# Altium project ADCSBoard.PrjPCB
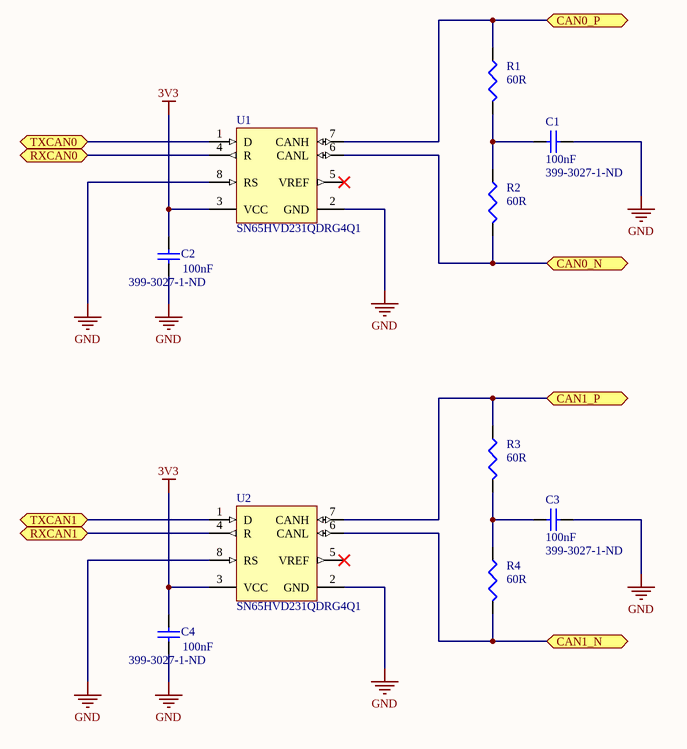
[diagram p0: CAN.SchDoc]
5 sheets, 69 parts. Net scope: flat (ports and power ports of the same name join across sheets).
Board file: SubSystems Development Board.PcbDoc
Sheets:
  CAN.SchDoc
  MCU Support.SchDoc
  MCU.SchDoc
  PERIPHERALS.SchDoc
  PINS.SchDoc

## Sheet CAN.SchDoc
size A4

### Parts
C1  value 100nF  Supplier Part Number 1: 399-3027-1-ND  [0402C-TBD]  (hidden comment: Cap Semi)
C2  value 100nF  Supplier Part Number 1: 399-3027-1-ND  [0402C-TBD]  (hidden comment: Cap Semi)
C3  value 100nF  Supplier Part Number 1: 399-3027-1-ND  [0402C-TBD]  (hidden comment: Cap Semi)
C4  value 100nF  Supplier Part Number 1: 399-3027-1-ND  [0402C-TBD]  (hidden comment: Cap Semi)
R1  value 60R  [0402R-TBD]  (hidden comment: Res3)
R2  value 60R  [0402R-TBD]  (hidden comment: Res3)
R3  value 60R  [0402R-TBD]  (hidden comment: Res3)
R4  value 60R  [0402R-TBD]  (hidden comment: Res3)
U1  SN65HVD231QDRG4Q1  [D8_M]
U2  SN65HVD231QDRG4Q1  [D8_M]

### Ports
CAN0_N (bidir), CAN0_P (bidir), CAN1_N (bidir), CAN1_P (bidir), RXCAN0 (bidir), RXCAN1 (bidir), TXCAN0 (bidir), TXCAN1 (bidir)

### Nets
3V3: C2.1 C4.1 U1.3(VCC) U2.3(VCC)
GND: C1.2 C2.2 C3.2 C4.2 U1.2(GND) U1.8(RS) U2.2(GND) U2.8(RS)
RXCAN0: U1.4(R) ; port RXCAN0
RXCAN1: U2.4(R) ; port RXCAN1
TXCAN0: U1.1(D) ; port TXCAN0
TXCAN1: U2.1(D) ; port TXCAN1
NetC1_1: C1.1 R1.2 R2.1
NetC3_1: C3.1 R3.2 R4.1
NetCAN1_1: R1.1 U1.7(CANH) ; port CAN0_P
NetCAN1_2: R3.1 U2.7(CANH) ; port CAN1_P
NetCAN1_3: R2.2 U1.6(CANL) ; port CAN0_N
NetCAN1_4: R4.2 U2.6(CANL) ; port CAN1_N

Not connected (* = marked no-connect by the designer): U1 5(VREF)*; U2 5(VREF)*

### Library data of the parts
C1-C4 = Cap Semi: Capacitor (Semiconductor SIM Model); Manufacturer: Kemet; Manufacturer Part Number: C0402C104K8PACTU; Capacitance: 0.1µF; Tolerance: ±10%; Voltage - Rated: 10V; Temperature Coefficient: X5R; Published: 8-Jun-2000; LatestRevisionDate: 29-May-2009; LatestRevisionNote: IPC-7351 Footprint Added.; PackageReference: C1206; Publisher: Altium Limited; PackageDescription: Chip Capacitor; Supplier 1: Digi-Key; RoHS: RoHS Compliant; Category: Capacitors; Stock 1: 806297; Pricing 1: 1=0.12, 10=0.031, 50=0.0174, 100=0.0147, 250=0.012, 500=0.01028, 1000=0.00799, 2500=0.0072, 5000=0.00666 (CAD); Packaging: Cut Tape (CT); Mounting Type: Surface Mount, MLCC; Operating Temperature: -55°C ~ 85°C; Applications: General Purpose; Ratings: -; Package / Case: 0402 (1005 Metric); Size / Dimension: 0.039" L x 0.020" W (1.00mm x 0.50mm); Height - Seated (Max): -; Thickness (Max): 0.022" (0.55mm); Lead Spacing: -; Features: -; Lead Style: -; ComponentLink1URL: http://www.kemet.com/docfinder?Partnumber=C0402C104K8PACTU; ComponentLink1Description: http://www.kemet.com/docfinder?Partnumber=C0402C104K8PACTU; Digi-Key Part Number: 399-3027-1-ND
R1-R4 = Res3: Resistor; Published: 8-Jun-2000; LatestRevisionDate: 29-May-2009; LatestRevisionNote: IPC-7351 Footprint Added.; PackageReference: J1-0603; Publisher: Altium Limited; PackageDescription: Chip Resistor; Digi-Key Part Number: 541-120GCT-ND
U1 U2 = CMP-0315-00034-1: Automotive Catalog CAN Transceiver, 17 mA, 3.3 V, -40 to 125 degC, 8-pin SOIC (D), Green (RoHS & no Sb/Br); Manufacturer: Texas Instruments; ICC(Max)(mA): 17; Supply Voltage(s)(V): 3.3; Receivers Per Package: 1; Transient Pulse Protection(V): -25 to 25; Mounting Technology: Surface Mount; DatasheetVersion: SGLS398A; Eco-Plan: Green (RoHS & no Sb/Br); PackageDescription: 8-Pin Plastic Small Outline Integrated Circuit, 4.9 x 3.9 mm, Pitch 1.27 mm Pitch; ComponentLink1URL: http://www.ti.com/general/docs/lit/getliterature.tsp?genericPartNumber=SN65HVD231Q-Q1&fileType=pdf; Isolated: No; SubFamily: CAN; Rating: Automotive; ComponentLink1Description: Datasheet; PackageVersion: revM, Jun-2011; Code_JEDEC: MS-012AA; Footprint: PCA82C250; PartNumber: SN65HVD231QDRG4Q1; PackageReference: D8; Drivers Per Package: 1

## Sheet MCU Support.SchDoc
size A4
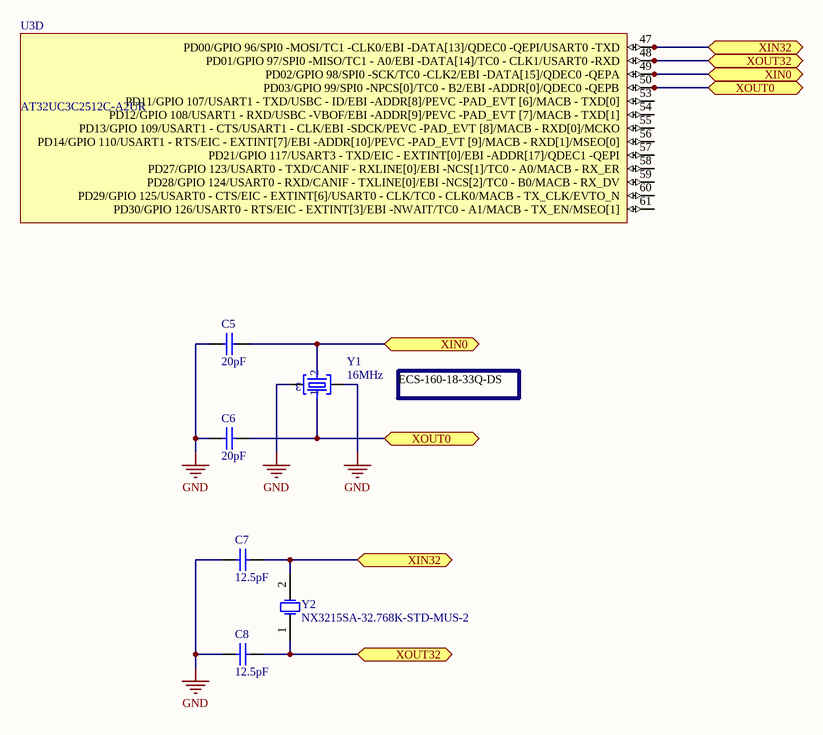
[diagram p1: MCU Support.SchDoc]

### Parts
(Parts that share a designator on the sheet are numbered #1, #2 ... from top to bottom, then left to right.)
C5  value 20pF  [0402C-TBD]  (hidden comment: Cap Semi)
C6  value 20pF  [0402C-TBD]  (hidden comment: Cap Semi)
C7  value 12.5pF  [0402C-TBD]  (hidden comment: Cap Semi)
C8  value 12.5pF  [0402C-TBD]  (hidden comment: Cap Semi)
U3#1  AT32UC3C2512C-A2UR  [TQFP64_N]  (part D of 6)
Y1  16MHz  [CRYSTAL-3.2-2.5]
Y2  NX3215SA-32.768K-STD-MUS-2  [ABRA-ABS07-2_V]

### Ports
XIN0 (bidir), XIN32 (bidir), XOUT0 (bidir), XOUT32 (bidir)

### Nets
GND: C5.2 C6.2 C7.2 C8.2 Y1.2(GND@1) Y1.4(GND@2)
NetC5_1: C5.1 U3#1.49(PD02/GPIO_98/SPI0_-SCK/TC0_-CLK2/EBI_-DATA[15]/QDEC0_-QEPA) Y1.3(C2) ; port XIN0
NetC6_1: C6.1 U3#1.50(PD03/GPIO_99/SPI0_-NPCS[0]/TC0_-_B2/EBI_-ADDR[0]/QDEC0_-QEPB) Y1.1(C1) ; port XOUT0
NetC7_1: C7.1 U3#1.47(PD00/GPIO_96/SPI0_-MOSI/TC1_-CLK0/EBI_-DATA[13]/QDEC0_-QEPI/USART0_-TXD) Y2.2(X2) ; port XIN32
NetC8_1: C8.1 U3#1.48(PD01/GPIO_97/SPI0_-MISO/TC1_-_A0/EBI_-DATA[14]/TC0_-_CLK1/USART0_-RXD) Y2.1(X1) ; port XOUT32

Not connected (* = marked no-connect by the designer): U3#1 53(PD11/GPIO_107/USART1_-_TXD/USBC_-_ID/EBI_-ADDR[8]/PEVC_-PAD_EVT_[6]/MACB_-_TXD[0]) 54(PD12/GPIO_108/USART1_-_RXD/USBC_-VBOF/EBI_-ADDR[9]/PEVC_-PAD_EVT_[7]/MACB_-_TXD[1]) 55(PD13/GPIO_109/USART1_-_CTS/USART1_-_CLK/EBI_-SDCK/PEVC_-PAD_EVT_[8]/MACB_-_RXD[0]/MCKO) 56(PD14/GPIO_110/USART1_-_RTS/EIC_-_EXTINT[7]/EBI_-ADDR[10]/PEVC_-PAD_EVT_[9]/MACB_-_RXD[1]/MSEO[0]) 57(PD21/GPIO_117/USART3_-_TXD/EIC_-_EXTINT[0]/EBI_-ADDR[17]/QDEC1_-QEPI) 58(PD27/GPIO_123/USART0_-_TXD/CANIF_-_RXLINE[0]/EBI_-NCS[1]/TC0_-_A0/MACB_-_RX_ER) 59(PD28/GPIO_124/USART0_-_RXD/CANIF_-_TXLINE[0]/EBI_-NCS[2]/TC0_-_B0/MACB_-_RX_DV) 60(PD29/GPIO_125/USART0_-_CTS/EIC_-_EXTINT[6]/USART0_-_CLK/TC0_-_CLK0/MACB_-_TX_CLK/EVTO_N) 61(PD30/GPIO_126/USART0_-_RTS/EIC_-_EXTINT[3]/EBI_-NWAIT/TC0_-_A1/MACB_-_TX_EN/MSEO[1])

### Notes on the sheet
- ECS-160-18-33Q-DS

### Library data of the parts
C5-C8 = Cap Semi: Capacitor (Semiconductor SIM Model); Published: 8-Jun-2000; LatestRevisionDate: 29-May-2009; LatestRevisionNote: IPC-7351 Footprint Added.; PackageReference: C1206; Publisher: Altium Limited; PackageDescription: Chip Capacitor
U3#1 = CMP-0092-00216-1: 32-bit AVR UC3 C Series Microcontroller, 512KB Flash, 68KB SRAM, 45 GPIO pins, Industrial Grade, 64- Pin TQFP, Reel; ComponentLink3URL: http://www.atmel.com/dyn/resources/prod_documents/32117s.pdf; PackageReference: TQFP64; ComponentLink3Description: AT32UC3C Summary; PackageVersion: 2011; DatasheetVersion: revC, Aug-2011; ComponentLink1Description: Manufacturer URL; ComponentLink2URL: http://www.atmel.com/dyn/resources/prod_documents/doc32117.pdf; ComponentLink2Description: AT32UC3C Datasheet; Code_JEDEC: MS-026; PackageDescription: 64-Pin Thin Quad Flat Pack, 10 x 10 x 1.0 mm Body, 0.5 mm Pitch; ComponentLink1URL: http://www.atmel.com/; PartId: 1
Y1 = CRYSTAL-3.2-2.5: Mouser Part Number: 581-CX3225GB22579PHP
Y2 = CMP-0447-00001-2: Crystal, 32.768 kHz, 12.5 pF, -40 to 85 degC, SMD Low Profile 3.2 x 1.5 x 0.9 mm, Tape and Reel; Manufacturer: Abracon; PartNumber: ABS07-32.768KHz-T; Q Value (Type): 30000; Operation Mode: Flexural Mode (Tuning Fork); Shunt Capacitance (C0): 0.9 to 1.2 pF; Load Capacitance (CL): 12.5 pF; Frequency Tolerance @+25degC: +/- 20 ppm; Drive Level (Type): 0.1 uW; Equivalent Series Resistance (R1): 70 Kohm; Insulation Resistance (Min): 500 Mohm; ComponentLink3URL: http://www.abracon.com/Resonators/ABS07.pdf; PackageDescription: 2-Pin Hand Drawn, Body 3.2x1.5mm, Pitch 2.5mm; Operating Temperature: -40 to 85 degC; ComponentLink2URL: http://www.abracon.com/Resonators/ABS07.pdf; PackageReference: ABS07-2; ComponentLink3Description: Package Specification; ComponentLink1Description: Manufacturer URL; DatasheetVersion: 04.03.13; Mounting Technology: Surface Mount; ComponentLink2Description: Datasheet; ComponentLink1URL: http://www.abracon.com/; Packing: Tape and Reel; Frequency: 32.768 kHz; Digi-Key Part Number: 535-9542-6-ND

## Sheet MCU.SchDoc
size A4
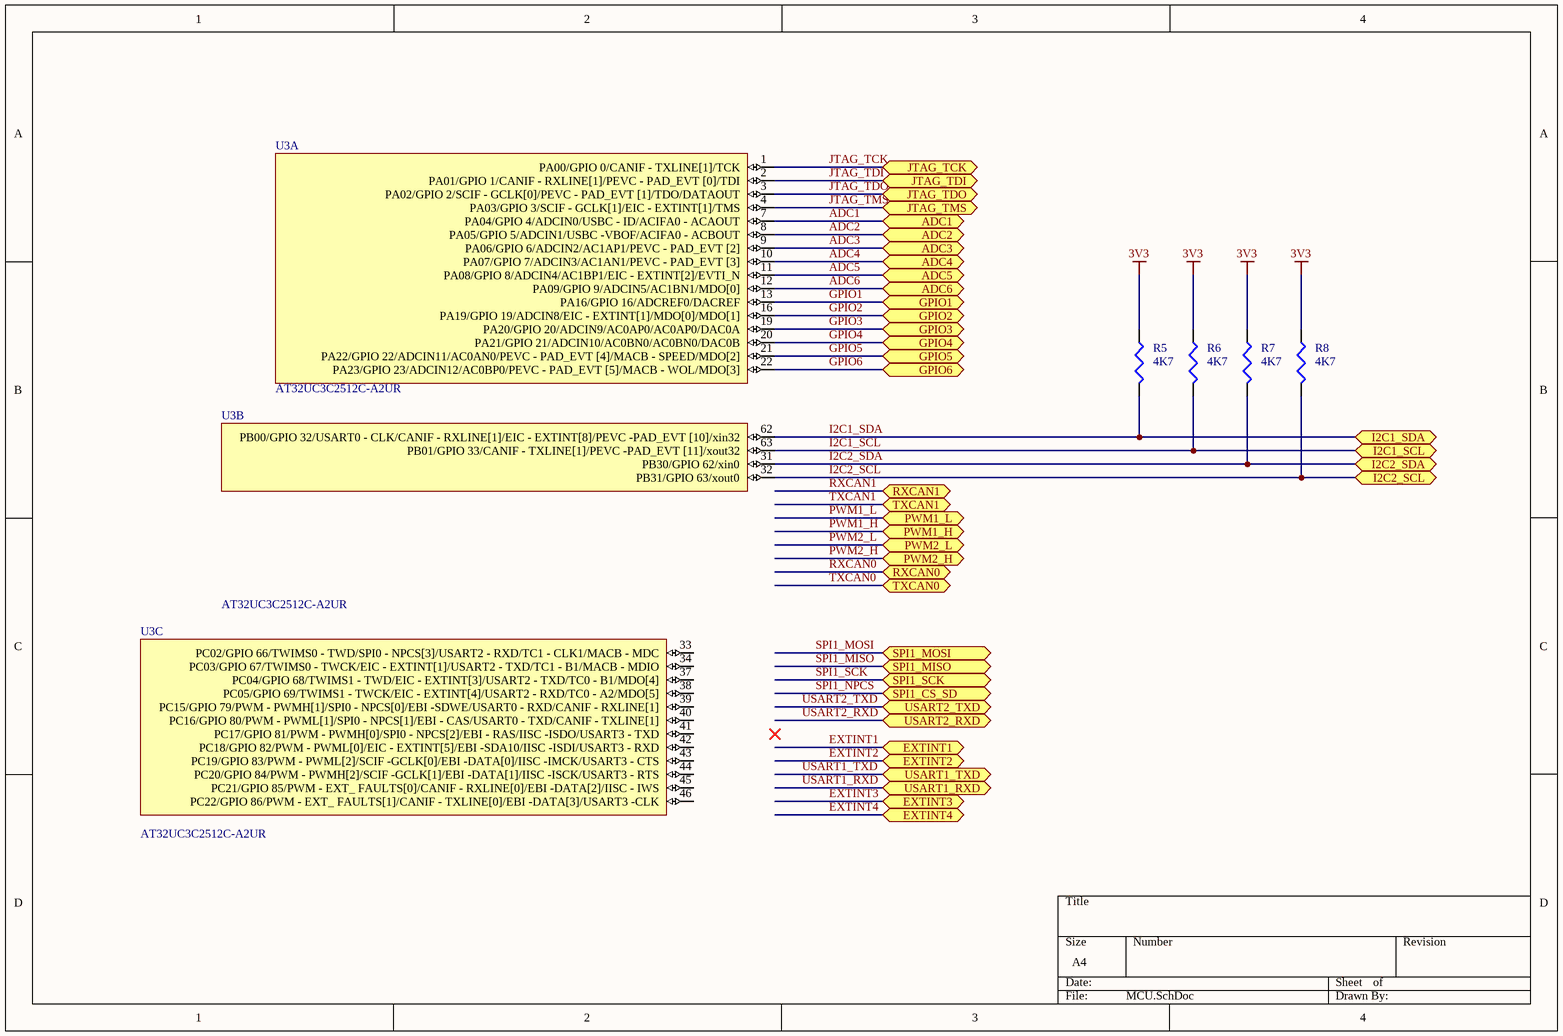
[diagram p2: MCU.SchDoc]

### Parts
(Parts that share a designator on the sheet are numbered #1, #2 ... from top to bottom, then left to right.)
R5  value 4K7  [0402R-TBD]  (hidden comment: Res3)
R6  value 4K7  [0402R-TBD]  (hidden comment: Res3)
R7  value 4K7  [0402R-TBD]  (hidden comment: Res3)
R8  value 4K7  [0402R-TBD]  (hidden comment: Res3)
U3#1  AT32UC3C2512C-A2UR  [TQFP64_N]  (parts B,C of 6)
U3#2  AT32UC3C2512C-A2UR  [TQFP64_N]  (part A of 6)

### Ports
ADC1 (bidir), ADC2 (bidir), ADC3 (bidir), ADC4 (bidir), ADC5 (bidir), ADC6 (bidir), EXTINT1 (bidir), EXTINT2 (bidir), EXTINT3 (bidir), EXTINT4 (bidir), GPIO1 (bidir), GPIO2 (bidir), GPIO3 (bidir), GPIO4 (bidir), GPIO5 (bidir), GPIO6 (bidir), I2C1_SCL (bidir), I2C1_SDA (bidir), I2C2_SCL (bidir), I2C2_SDA (bidir), JTAG_TCK (bidir), JTAG_TDI (bidir), JTAG_TDO (bidir), JTAG_TMS (bidir), PWM1_H (bidir), PWM1_L (bidir), PWM2_H (bidir), PWM2_L (bidir), RXCAN0 (bidir), RXCAN1 (bidir), SPI1_CS_SD (bidir), SPI1_MISO (bidir), SPI1_MOSI (bidir), SPI1_SCK (bidir), TXCAN0 (bidir), TXCAN1 (bidir), USART1_RXD (bidir), USART1_TXD (bidir), USART2_RXD (bidir), USART2_TXD (bidir)

### Nets
3V3: R5.1 R6.1 R7.1 R8.1
ADC1: U3#2.7(PA04/GPIO_4/ADCIN0/USBC_-_ID/ACIFA0_-_ACAOUT) ; port ADC1
ADC2: U3#2.8(PA05/GPIO_5/ADCIN1/USBC_-VBOF/ACIFA0_-_ACBOUT) ; port ADC2
ADC3: U3#2.9(PA06/GPIO_6/ADCIN2/AC1AP1/PEVC_-_PAD_EVT_[2]) ; port ADC3
ADC4: U3#2.10(PA07/GPIO_7/ADCIN3/AC1AN1/PEVC_-_PAD_EVT_[3]) ; port ADC4
ADC5: U3#2.11(PA08/GPIO_8/ADCIN4/AC1BP1/EIC_-_EXTINT[2]/EVTI_N) ; port ADC5
ADC6: U3#2.12(PA09/GPIO_9/ADCIN5/AC1BN1/MDO[0]) ; port ADC6
GPIO1: U3#2.13(PA16/GPIO_16/ADCREF0/DACREF) ; port GPIO1
GPIO2: U3#2.16(PA19/GPIO_19/ADCIN8/EIC_-_EXTINT[1]/MDO[0]/MDO[1]) ; port GPIO2
GPIO3: U3#2.19(PA20/GPIO_20/ADCIN9/AC0AP0/AC0AP0/DAC0A) ; port GPIO3
GPIO4: U3#2.20(PA21/GPIO_21/ADCIN10/AC0BN0/AC0BN0/DAC0B) ; port GPIO4
GPIO5: U3#2.21(PA22/GPIO_22/ADCIN11/AC0AN0/PEVC_-_PAD_EVT_[4]/MACB_-_SPEED/MDO[2]) ; port GPIO5
GPIO6: U3#2.22(PA23/GPIO_23/ADCIN12/AC0BP0/PEVC_-_PAD_EVT_[5]/MACB_-_WOL/MDO[3]) ; port GPIO6
I2C1_SCL: R6.2 U3#1.63(PB01/GPIO_33/CANIF_-_TXLINE[1]/PEVC_-PAD_EVT_[11]/xout32) ; port I2C1_SCL
I2C1_SDA: R5.2 U3#1.62(PB00/GPIO_32/USART0_-_CLK/CANIF_-_RXLINE[1]/EIC_-_EXTINT[8]/PEVC_-PAD_EVT_[10]/xin32) ; port I2C1_SDA
I2C2_SCL: R8.2 U3#1.32(PB31/GPIO_63/xout0) ; port I2C2_SCL
I2C2_SDA: R7.2 U3#1.31(PB30/GPIO_62/xin0) ; port I2C2_SDA
JTAG_TCK: U3#2.1(PA00/GPIO_0/CANIF_-_TXLINE[1]/TCK) ; port JTAG_TCK
JTAG_TDI: U3#2.2(PA01/GPIO_1/CANIF_-_RXLINE[1]/PEVC_-_PAD_EVT_[0]/TDI) ; port JTAG_TDI
JTAG_TDO: U3#2.3(PA02/GPIO_2/SCIF_-_GCLK[0]/PEVC_-_PAD_EVT_[1]/TDO/DATAOUT) ; port JTAG_TDO
JTAG_TMS: U3#2.4(PA03/GPIO_3/SCIF_-_GCLK[1]/EIC_-_EXTINT[1]/TMS) ; port JTAG_TMS
PWM1_H: port PWM1_H
PWM1_L: port PWM1_L
PWM2_H: port PWM2_H
PWM2_L: port PWM2_L

Not connected (* = marked no-connect by the designer): U3#1 33(PC02/GPIO_66/TWIMS0_-_TWD/SPI0_-_NPCS[3]/USART2_-_RXD/TC1_-_CLK1/MACB_-_MDC) 34(PC03/GPIO_67/TWIMS0_-_TWCK/EIC_-_EXTINT[1]/USART2_-_TXD/TC1_-_B1/MACB_-_MDIO) 37(PC04/GPIO_68/TWIMS1_-_TWD/EIC_-_EXTINT[3]/USART2_-_TXD/TC0_-_B1/MDO[4]) 38(PC05/GPIO_69/TWIMS1_-_TWCK/EIC_-_EXTINT[4]/USART2_-_RXD/TC0_-_A2/MDO[5]) 39(PC15/GPIO_79/PWM_-_PWMH[1]/SPI0_-_NPCS[0]/EBI_-SDWE/USART0_-_RXD/CANIF_-_RXLINE[1]) 40(PC16/GPIO_80/PWM_-_PWML[1]/SPI0_-_NPCS[1]/EBI_-_CAS/USART0_-_TXD/CANIF_-_TXLINE[1]) 41(PC17/GPIO_81/PWM_-_PWMH[0]/SPI0_-_NPCS[2]/EBI_-_RAS/IISC_-ISDO/USART3_-_TXD) 42(PC18/GPIO_82/PWM_-_PWML[0]/EIC_-_EXTINT[5]/EBI_-SDA10/IISC_-ISDI/USART3_-_RXD) 43(PC19/GPIO_83/PWM_-_PWML[2]/SCIF_-GCLK[0]/EBI_-DATA[0]/IISC_-IMCK/USART3_-_CTS) 44(PC20/GPIO_84/PWM_-_PWMH[2]/SCIF_-GCLK[1]/EBI_-DATA[1]/IISC_-ISCK/USART3_-_RTS) 45(PC21/GPIO_85/PWM_-_EXT__FAULTS[0]/CANIF_-_RXLINE[0]/EBI_-DATA[2]/IISC_-_IWS) 46(PC22/GPIO_86/PWM_-_EXT__FAULTS[1]/CANIF_-_TXLINE[0]/EBI_-DATA[3]/USART3_-CLK)

### Library data of the parts
R5-R8 = Res3: Resistor; Published: 8-Jun-2000; LatestRevisionDate: 29-May-2009; LatestRevisionNote: IPC-7351 Footprint Added.; PackageReference: J1-0603; Publisher: Altium Limited; PackageDescription: Chip Resistor; Digi-Key Part Number: 541-120GCT-ND
U3#1 U3#2 = CMP-0092-00216-1: as U3#1 on sheet MCU Support; ComponentLink3URL: http://www.atmel.com/dyn/resources/prod_documents/32117s.pdf; PackageReference: TQFP64; ComponentLink3Description: AT32UC3C Summary; PackageVersion: 2011; DatasheetVersion: revC, Aug-2011; ComponentLink1Description: Manufacturer URL; ComponentLink2URL: http://www.atmel.com/dyn/resources/prod_documents/doc32117.pdf; ComponentLink2Description: AT32UC3C Datasheet; Code_JEDEC: MS-026; PackageDescription: 64-Pin Thin Quad Flat Pack, 10 x 10 x 1.0 mm Body, 0.5 mm Pitch; ComponentLink1URL: http://www.atmel.com/; PartId: 1

## Sheet PERIPHERALS.SchDoc
size A4
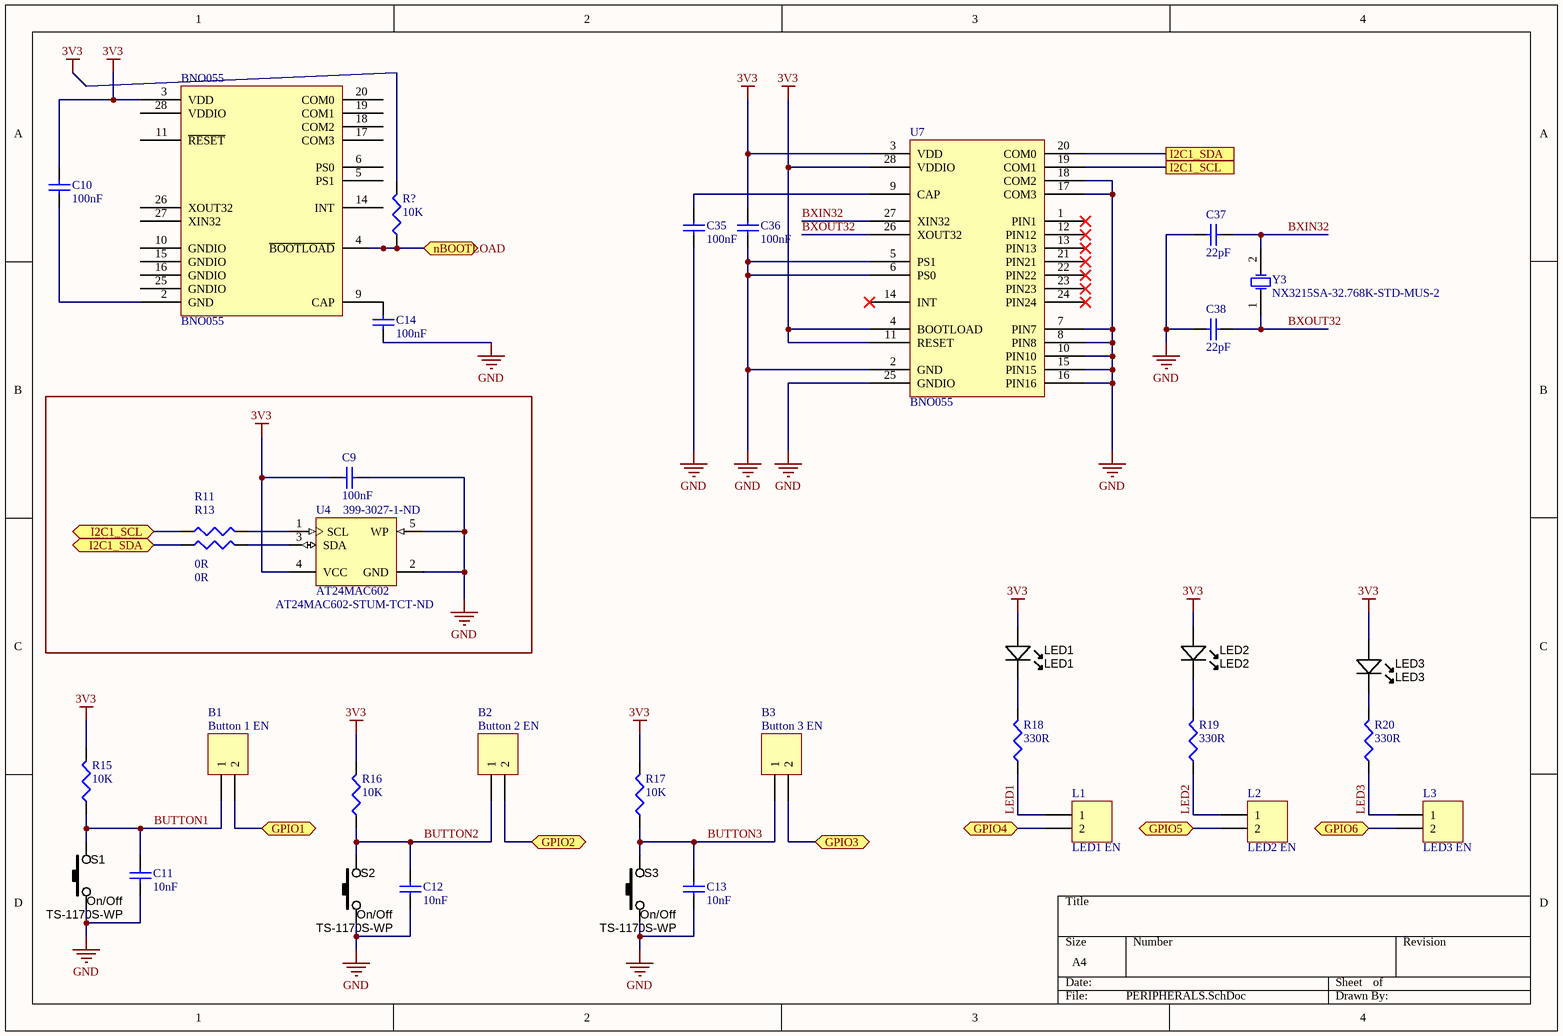
[diagram p3: PERIPHERALS.SchDoc]

### Parts
B1  Button 1 EN  [HDR1X2]
B2  Button 2 EN  [HDR1X2]
B3  Button 3 EN  [HDR1X2]
BNO055  BNO055  [BOSCH LGA-28 5.2x3.8MM]
C9  value 100nF  Supplier Part Number 1: 399-3027-1-ND  [0402C-TBD]  (hidden comment: Cap Semi)
C10  value 100nF  [0402C-TBD]  (hidden comment: Cap Semi)
C11  value 10nF  [0402C-TBD]  (hidden comment: Cap Semi)
C12  value 10nF  [0402C-TBD]  (hidden comment: Cap Semi)
C13  value 10nF  [0402C-TBD]  (hidden comment: Cap Semi)
C14  value 100nF  [0402C-TBD]  (hidden comment: Cap Semi)
C35  value 100nF  [0402C-TBD]  (hidden comment: Cap Semi)
C36  value 100nF  [0402C-TBD]  (hidden comment: Cap Semi)
C37  value 22pF  [0402C-TBD]  (hidden comment: Cap Semi)
C38  value 22pF  [0402C-TBD]  (hidden comment: Cap Semi)
L1  LED1 EN  [HDR1X2]
L2  LED2 EN  [HDR1X2]
L3  LED3 EN  [HDR1X2]
LED1  LED1  [LED-0603-GREEN]
LED2  LED2  [LED-0603-GREEN]
LED3  LED3  [LED-0603-GREEN]
R11  value 0R  [0402R-TBD]  (hidden comment: Res3)
R13  value 0R  [0402R-TBD]  (hidden comment: Res3)
R15  value 10K  [0402R-TBD]  (hidden comment: Res3)
R16  value 10K  [0402R-TBD]  (hidden comment: Res3)
R17  value 10K  [0402R-TBD]  (hidden comment: Res3)
R18  value 330R  [0402R-TBD]  (hidden comment: Res3)
R19  value 330R  [0402R-TBD]  (hidden comment: Res3)
R20  value 330R  [0402R-TBD]  (hidden comment: Res3)
R?  value 10K  [0402R-TBD]  (hidden comment: Res3)
S1  TS-1170S-WP  Function: On/Off  [TS-1170S]
S2  TS-1170S-WP  Function: On/Off  [TS-1170S]
S3  TS-1170S-WP  Function: On/Off  [TS-1170S]
U4  AT24MAC602  Supplier Part Number 1: AT24MAC602-STUM-TCT-ND  [ATML-5TS1-5_N]
U7  BNO055  [BNO055]
Y3  NX3215SA-32.768K-STD-MUS-2  [ABRA-ABS07-2_V]

### Ports
GPIO1 (bidir), GPIO2 (bidir), GPIO3 (bidir), GPIO4 (bidir), GPIO5 (bidir), GPIO6 (bidir), I2C1_SCL, I2C1_SCL (bidir), I2C1_SDA, I2C1_SDA (bidir), nBOOTLOAD (bidir)

### Nets
3V3: BNO055.3(VDD) C9.2 C10.2 C36.2 LED1.A LED2.A LED3.A R15.2 R16.2 R17.2 R?.2 U4.4(VCC) U7.3(VDD) U7.4(BOOTLOAD) U7.11(RESET) U7.28(VDDIO)
GND: C9.1 C11.1 C12.1 C13.1 C14.1 C35.1 C36.1 C37.2 C38.2 S1.1 S2.1 S3.1 U4.2(GND) U4.5(WP) U7.2(GND) U7.5(PS1) U7.6(PS0) U7.7(PIN7) U7.8(PIN8) U7.10(PIN10) U7.15(PIN15) U7.16(PIN16) U7.17(COM3) U7.18(COM2) U7.25(GNDIO)
BUTTON1: B1.1 C11.2 R15.1 S1.2
BUTTON2: B2.1 C12.2 R16.1 S2.2
BUTTON3: B3.1 C13.2 R17.1 S3.2
BXIN32: C37.1 U7.27(XIN32) Y3.2(X2)
BXOUT32: C38.1 U7.26(XOUT32) Y3.1(X1)
GPIO1: B1.2 ; port GPIO1
GPIO2: B2.2 ; port GPIO2
GPIO3: B3.2 ; port GPIO3
GPIO4: L1.2 ; port GPIO4
GPIO5: L2.2 ; port GPIO5
GPIO6: L3.2 ; port GPIO6
I2C1_SCL: R11.1 U7.19(COM1) ; port I2C1_SCL
I2C1_SDA: R13.1 U7.20(COM0) ; port I2C1_SDA
LED1: L1.1 R18.1
LED2: L2.1 R19.1
LED3: L3.1 R20.1
NetBNO055_2: BNO055.2(GND) C10.1
NetBNO055_4: BNO055.4(~{BOOTL}~{OAD}) R?.1 ; port nBOOTLOAD
NetBNO055_9: BNO055.9(CAP) C14.2
NetC35_2: C35.2 U7.9(CAP)
NetLED1_K: LED1.K R18.2
NetLED2_K: LED2.K R19.2
NetLED3_K: LED3.K R20.2
NetR11_2: R11.2 U4.1(SCL)
NetR13_2: R13.2 U4.3(SDA)

Not connected (* = marked no-connect by the designer): BNO055 5(PS1) 6(PS0) 10(GNDIO) 11(~{RESET}) 14(INT) 15(GNDIO) 16(GNDIO) 17(COM3) 18(COM2) 19(COM1) 20(COM0) 25(GNDIO) 26(XOUT32) 27(XIN32) 28(VDDIO); U7 1(PIN1)* 12(PIN12)* 13(PIN13)* 14(INT)* 21(PIN21)* 22(PIN22)* 23(PIN23)* 24(PIN24)*

### Library data of the parts
B1-B3 L1-L3 = Header 2: Header, 2-Pin; LatestRevisionDate: 17-Jul-2002; LatestRevisionNote: Re-released for DXP Platform.; Publisher: Altium Limited
BNO055 = BNO055: 9 AXIS ORIENTATION SENSOR; Manufacturer: Bosch Sensortec; Sensor Type: Accelerometer, Gyroscope, Magnetometer, 3 Axis; Output Type: IC; Part Number: BNO055; PartId: 16469; Supplier 1: Digi-Key; Supplier Part Number 1: 828-1058-2-ND; ComponentLink1Description: Datasheet; ComponentLink1URL: https://ae-bst.resource.bosch.com/media/_tech/media/others/BST_Produktuebersicht_SCREEN_Final.pdf; ComponentLink2Description: Digi-Key Listing; ComponentLink2URL: http://www.digikey.com/product-detail/en/bosch-sensortec/BNO055/828-1058-2-ND/6136301; Price: 6.325; Type: Multifunction; Series: -; Operating Temperature: -40C ~ 85C (TA)
C9 C10 C14 C35 C36 = Cap Semi: Capacitor (Semiconductor SIM Model); Manufacturer: Kemet; Manufacturer Part Number: C0402C104K8PACTU; Capacitance: 0.1µF; Voltage - Rated: 10V; Tolerance: ±10%; Temperature Coefficient: X5R; Published: 8-Jun-2000; LatestRevisionDate: 29-May-2009; LatestRevisionNote: IPC-7351 Footprint Added.; PackageReference: C1206; Publisher: Altium Limited; PackageDescription: Chip Capacitor; Supplier 1: Digi-Key; RoHS: RoHS Compliant; Category: Capacitors; Stock 1: 563500; Pricing 1: 1=0.12, 10=0.03, 50=0.0166, 100=0.014, 250=0.01148, 500=0.0098, 1000=0.00763, 2500=0.00686, 5000=0.00636 (CAD); Packaging: Cut Tape (CT); Mounting Type: Surface Mount, MLCC; Operating Temperature: -55°C ~ 85°C; Applications: General Purpose; Ratings: -; Package / Case: 0402 (1005 Metric); Size / Dimension: 0.039" L x 0.020" W (1.00mm x 0.50mm); Height - Seated (Max): -; Thickness (Max): 0.022" (0.55mm); Lead Spacing: -; Features: -; Lead Style: -; ComponentLink1URL: http://www.kemet.com/docfinder?Partnumber=C0402C104K8PACTU; ComponentLink1Description: http://www.kemet.com/docfinder?Partnumber=C0402C104K8PACTU
  C10 C14 C35 C36: Supplier Part Number 1: 399-3027-1-ND
C11-C13 C37 C38 = Cap Semi: Capacitor (Semiconductor SIM Model); Published: 8-Jun-2000; LatestRevisionDate: 29-May-2009; LatestRevisionNote: IPC-7351 Footprint Added.; PackageReference: C1206; Publisher: Altium Limited; PackageDescription: Chip Capacitor
LED1-LED3 = LED_SMD_Green_0603_570nm: LED 0603 SMD Green 570nm 50mcd 20mA; Manufacturer 1: Kingbright Company LLC; Manufacturer Part Number 1: APT1608CGCK; Material: AlGaInP; Ratings: 20mcd min; 50 mcd typ; 570 nm; Voltage - Forward (Vf) Typ: 2.1V; Viewing Angle: 120°; Lens Style/Size: Rectangle with Flat Top, 1.1mm x 0.8mm; Voltage - Forward (Vf) @ 10mA: 2.0V; SCDType: source; Wavelength - Peak: 574nm; Lens Type: Clear; Package / Case: 0603 (1608 metric); Color: Green; Current - Test: 20mA; Supplier 1: Digi-Key; Supplier Part Number 1: 754-1116-1-ND; RoHS 1: RoHS Compliant; Wavelength - Dominant: 570nm; ComponentLink1URL: http://www.us.kingbright.com/images/catalog/SPEC/APT1608CGCK.pdf; ComponentLink1Description: http://www.us.kingbright.com/images/catalog/SPEC/APT1608CGCK.pdf
R11 R13 R15-R20 R? = Res3: Resistor; Published: 8-Jun-2000; LatestRevisionDate: 29-May-2009; LatestRevisionNote: IPC-7351 Footprint Added.; PackageReference: J1-0603; Publisher: Altium Limited; PackageDescription: Chip Resistor; Digi-Key Part Number: 541-120GCT-ND
S1-S3 = SW_SMD_PB_7.0mm: Switch SMD Tact 7.0mm Stem; Manufacturer 1: Bond-Tact; Manufacturer Part Number 1: TS-1170S-WP-200; SCDType: source; Package / Case: 6.5x6.5mm; 7.0mm stem; ComponentLink1URL: http://www.bondtact.com.hk/zaspx/productd.aspx?catno=3&subcatid=3&PageNo=2&productno=40; ComponentLink1Description: http://www.bondtact.com.hk/zaspx/productd.aspx?catno=3&subcatid=3&PageNo=2&productno=40
U4 = CMP-0152-00057-1: 1Kbit (128 x 8), 2-wire Bus Serial EEPROM with Write Protect, 1.7 to 5.5 V, -40 to 85 degC, SOT23-5, RoHS, Tape and Reel; Manufacturer: Atmel; PartNumber: AT24C01C-STUM-T; Manufacturer Part Number: AT24MAC602-STUM-T; Access Time (Max): 550 ns; DC Output Current: 5 mA; Frequency: 1 MHz; Format - Memory: EEPROMs - Serial (with MAC Address); Memory Size: 2K (256 x 8); Speed: 400kHz, 1MHz; Interface: I²C, 2-Wire Serial; Voltage - Supply: 1.7 V ~ 5.5 V; ComponentLink3Description: Package Specification; PackageVersion: 8700F; Mounting Technology: Surface Mount; Packing: Tape and Reel; ComponentLink1Description: Manufacturer URL; RoHS: TRUE; Operating Temperature: -40 to 85 degC; Operating Voltage: 1.7 to 5.5 V; PackageDescription: 5-Pin SOT23, Body 2.9 x 1.6 mm, Height 1.0mm, Pitch 0.95 mm; DatasheetVersion: Rev. 8700F; ComponentLink2URL: http://www.atmel.com/images/doc8700.pdf; ComponentLink3URL: http://www.atmel.com/images/doc8700.pdf; ComponentLink2Description: Datasheet; PackageReference: 5TS1; Device Density: 1 Kbit; ComponentLink1URL: http://www.atmel.com/; Supplier 1: Digi-Key; Category: Integrated Circuits (ICs); Stock 1: 4178; Pricing 1: 1=0.54, 10=0.537, 25=0.4988, 50=0.496, 100=0.4407, 250=0.4348, 500=0.42842, 1000=0.41684 (CAD); Packaging: Cut Tape (CT); Memory Type: EEPROM; Package / Case: SC-74A, SOT-753; Supplier Device Package: SOT-23-5; ComponentLink4URL: http://www.atmel.com/images/atmel-8807-seeprom-at24mac402-602-datasheet.pdf; ComponentLink4Description: http://www.atmel.com/images/atmel-8807-seeprom-at24mac402-602-datasheet.pdf
Y3 = CMP-0447-00001-2: as Y2 on sheet MCU Support; ComponentLink3URL: http://www.abracon.com/Resonators/ABS07.pdf; PackageDescription: 2-Pin Hand Drawn, Body 3.2x1.5mm, Pitch 2.5mm; Operating Temperature: -40 to 85 degC; ComponentLink2URL: http://www.abracon.com/Resonators/ABS07.pdf; PackageReference: ABS07-2; ComponentLink3Description: Package Specification; ComponentLink1Description: Manufacturer URL; DatasheetVersion: 04.03.13; Mounting Technology: Surface Mount; ComponentLink2Description: Datasheet; ComponentLink1URL: http://www.abracon.com/; Packing: Tape and Reel; Frequency: 32.768 kHz; Digi-Key Part Number: 535-9542-6-ND

## Sheet PINS.SchDoc
size A4
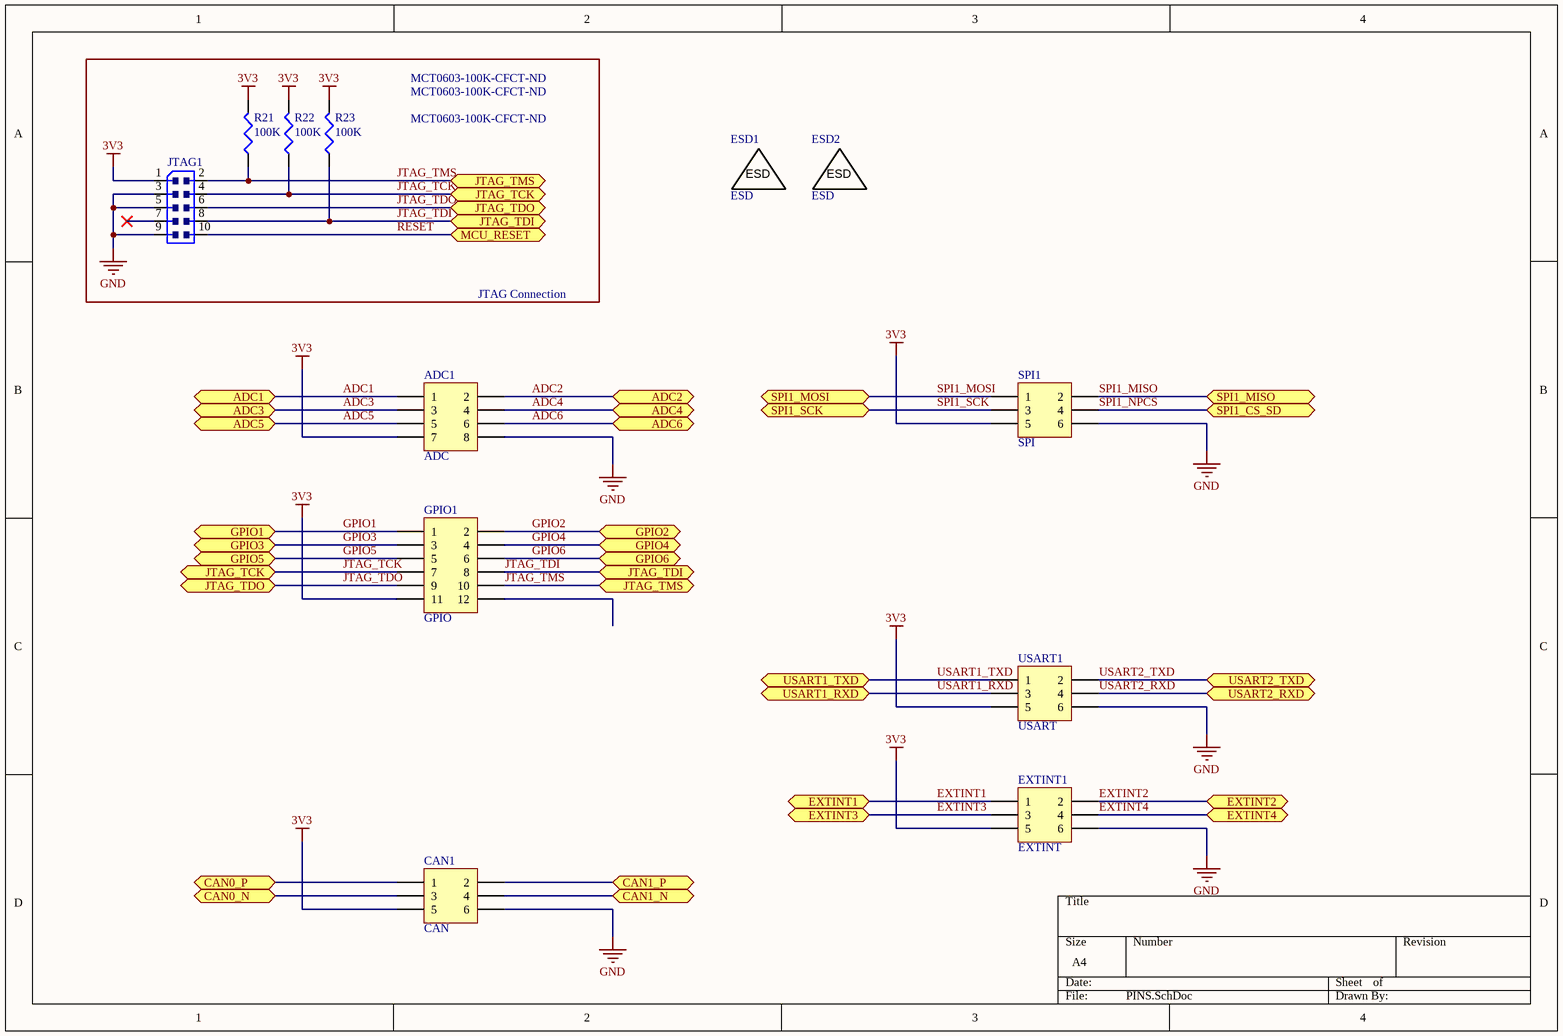
[diagram p4: PINS.SchDoc]

### Parts
ADC1  ADC  [HDR2X4]
CAN1  CAN  [HDR2X3]
ESD1  ESD  [ESDSILK]  (no BOM)
ESD2  ESD  [ESDSILK]  (no BOM)
EXTINT1  EXTINT  [HDR2X3]
GPIO1  GPIO  [HDR2X6]
JTAG1  *  [PINHEAD_2X05_127]  (value not drawn)
R21  value 100K  Supplier Part Number 1: MCT0603-100K-CFCT-ND  [0603R-GENERIC]  (hidden comment: Res3)
R22  value 100K  Supplier Part Number 1: MCT0603-100K-CFCT-ND  [0603R-GENERIC]  (hidden comment: Res3)
R23  value 100K  Supplier Part Number 1: MCT0603-100K-CFCT-ND  [0603R-GENERIC]  (hidden comment: Res3)
SPI1  SPI  [HDR2X3]
USART1  USART  [HDR2X3]

### Blocks framed on the sheet
JTAG Connection: JTAG1 R21-R23

### Ports
ADC1 (bidir), ADC2 (bidir), ADC3 (bidir), ADC4 (bidir), ADC5 (bidir), ADC6 (bidir), CAN0_N (bidir), CAN0_P (bidir), CAN1_N (bidir), CAN1_P (bidir), EXTINT1 (bidir), EXTINT2 (bidir), EXTINT3 (bidir), EXTINT4 (bidir), GPIO1 (bidir), GPIO2 (bidir), GPIO3 (bidir), GPIO4 (bidir), GPIO5 (bidir), GPIO6 (bidir), JTAG_TCK (bidir), JTAG_TDI (bidir), JTAG_TDO (bidir), JTAG_TMS (bidir), MCU_RESET (bidir), SPI1_CS_SD (bidir), SPI1_MISO (bidir), SPI1_MOSI (bidir), SPI1_SCK (bidir), USART1_RXD (bidir), USART1_TXD (bidir), USART2_RXD (bidir), USART2_TXD (bidir)

### Nets
3V3: ADC1.7 CAN1.5 EXTINT1.5 GPIO1.11 JTAG1.1 R21.2 R22.2 R23.2 SPI1.5 USART1.5
GND: ADC1.8 CAN1.6 EXTINT1.6 JTAG1.3 JTAG1.5 JTAG1.9 SPI1.6 USART1.6
ADC1: ADC1.1 ; port ADC1
ADC2: ADC1.2 ; port ADC2
ADC3: ADC1.3 ; port ADC3
ADC4: ADC1.4 ; port ADC4
ADC5: ADC1.5 ; port ADC5
ADC6: ADC1.6 ; port ADC6
EXTINT1: EXTINT1.1 ; port EXTINT1
EXTINT2: EXTINT1.2 ; port EXTINT2
EXTINT3: EXTINT1.3 ; port EXTINT3
EXTINT4: EXTINT1.4 ; port EXTINT4
GPIO1: GPIO1.1 ; port GPIO1
GPIO2: GPIO1.2 ; port GPIO2
GPIO3: GPIO1.3 ; port GPIO3
GPIO4: GPIO1.4 ; port GPIO4
GPIO5: GPIO1.5 ; port GPIO5
GPIO6: GPIO1.6 ; port GPIO6
JTAG_TCK: GPIO1.7 JTAG1.4 R22.1 ; port JTAG_TCK
JTAG_TDI: GPIO1.8 JTAG1.8 R23.1 ; port JTAG_TDI
JTAG_TDO: GPIO1.9 JTAG1.6 ; port JTAG_TDO
JTAG_TMS: GPIO1.10 JTAG1.2 R21.1 ; port JTAG_TMS
RESET: JTAG1.10 ; port MCU_RESET
SPI1_MISO: SPI1.2 ; port SPI1_MISO
SPI1_MOSI: SPI1.1 ; port SPI1_MOSI
SPI1_NPCS: SPI1.4 ; port SPI1_CS_SD
SPI1_SCK: SPI1.3 ; port SPI1_SCK
USART1_RXD: USART1.3 ; port USART1_RXD
USART1_TXD: USART1.1 ; port USART1_TXD
USART2_RXD: USART1.4 ; port USART2_RXD
USART2_TXD: USART1.2 ; port USART2_TXD
NetCAN1_1: CAN1.1 ; port CAN0_P
NetCAN1_2: CAN1.2 ; port CAN1_P
NetCAN1_3: CAN1.3 ; port CAN0_N
NetCAN1_4: CAN1.4 ; port CAN1_N

Not connected (* = marked no-connect by the designer): GPIO1 12; JTAG1 7*

### Library data of the parts
ADC1 = Header 4X2: Header, 4-Pin, Dual row; LatestRevisionDate: 17-Jul-2002; LatestRevisionNote: Re-released for DXP Platform.; Publisher: Altium Limited
CAN1 EXTINT1 SPI1 USART1 = Header 3X2: Header, 3-Pin, Dual row; LatestRevisionDate: 17-Jul-2002; LatestRevisionNote: Re-released for DXP Platform.; Publisher: Altium Limited
ESD1 ESD2 = ESD: ESD LOGO
GPIO1 = Header 6X2: Header, 6-Pin, Dual row; LatestRevisionDate: 17-Jul-2002; LatestRevisionNote: Re-released for DXP Platform.; Publisher: Altium Limited
JTAG1 = PINHEAD_PINHD-2X5PASSO127
R21-R23 = Res3: Resistor; Manufacturer: Vishay Beyschlag; Manufacturer Part Number: MCT06030C1003FP500; Tolerance: ±1%; Power (Watts): 0.125W, 1/8W; Temperature Coefficient: ±50ppm/°C; Published: 8-Jun-2000; LatestRevisionDate: 29-May-2009; LatestRevisionNote: IPC-7351 Footprint Added.; PackageReference: J1-0603; Publisher: Altium Limited; PackageDescription: Chip Resistor; Supplier 1: Digi-Key; RoHS: RoHS Compliant; Category: Resistors; Stock 1: 56018; Pricing 1: 1=0.1, 10=0.089, 50=0.0666, 100=0.0526, 500=0.04256, 1000=0.03095 (CAD); Packaging: Cut Tape (CT); Resistance (Ohms): 100k; Composition: Thin Film; Features: -; Operating Temperature: -55°C ~ 155°C; Package / Case: 0603 (1608 Metric); Supplier Device Package: 0603; Size / Dimension: 0.061" L x 0.033" W (1.55mm x 0.85mm); Height: 0.022" (0.55mm); Number of Terminations: 2; ComponentLink1URL: http://www.vishay.com/docs/28705/mc_pro.pdf; ComponentLink1Description: http://www.vishay.com/docs/28705/mc_pro.pdf

## Nets that join several sheets
3V3: CAN (C2.1 C4.1 U1.3 U2.3), MCU (R5.1 R6.1 R7.1 R8.1), PERIPHERALS (16 pins), PINS (10 pins)
GND: CAN (8 pins), MCU Support (6 pins), PERIPHERALS (25 pins), PINS (8 pins)
ADC1: MCU (U3#2.7), PINS (ADC1.1)
ADC2: MCU (U3#2.8), PINS (ADC1.2)
ADC3: MCU (U3#2.9), PINS (ADC1.3)
ADC4: MCU (U3#2.10), PINS (ADC1.4)
ADC5: MCU (U3#2.11), PINS (ADC1.5)
ADC6: MCU (U3#2.12), PINS (ADC1.6)
GPIO1: MCU (U3#2.13), PERIPHERALS (B1.2), PINS (GPIO1.1)
GPIO2: MCU (U3#2.16), PERIPHERALS (B2.2), PINS (GPIO1.2)
GPIO3: MCU (U3#2.19), PERIPHERALS (B3.2), PINS (GPIO1.3)
GPIO4: MCU (U3#2.20), PERIPHERALS (L1.2), PINS (GPIO1.4)
GPIO5: MCU (U3#2.21), PERIPHERALS (L2.2), PINS (GPIO1.5)
GPIO6: MCU (U3#2.22), PERIPHERALS (L3.2), PINS (GPIO1.6)
I2C1_SCL: MCU (R6.2 U3#1.63), PERIPHERALS (R11.1 U7.19)
I2C1_SDA: MCU (R5.2 U3#1.62), PERIPHERALS (R13.1 U7.20)
JTAG_TCK: MCU (U3#2.1), PINS (GPIO1.7 JTAG1.4 R22.1)
JTAG_TDI: MCU (U3#2.2), PINS (GPIO1.8 JTAG1.8 R23.1)
JTAG_TDO: MCU (U3#2.3), PINS (GPIO1.9 JTAG1.6)
JTAG_TMS: MCU (U3#2.4), PINS (GPIO1.10 JTAG1.2 R21.1)
NetCAN1_1: CAN (R1.1 U1.7), PINS (CAN1.1)
NetCAN1_2: CAN (R3.1 U2.7), PINS (CAN1.2)
NetCAN1_3: CAN (R2.2 U1.6), PINS (CAN1.3)
NetCAN1_4: CAN (R4.2 U2.6), PINS (CAN1.4)